# Altium schematic sheet Temperature_Sensing.SchDoc
size A4; SheetNumber: 5; SheetTotal: 6
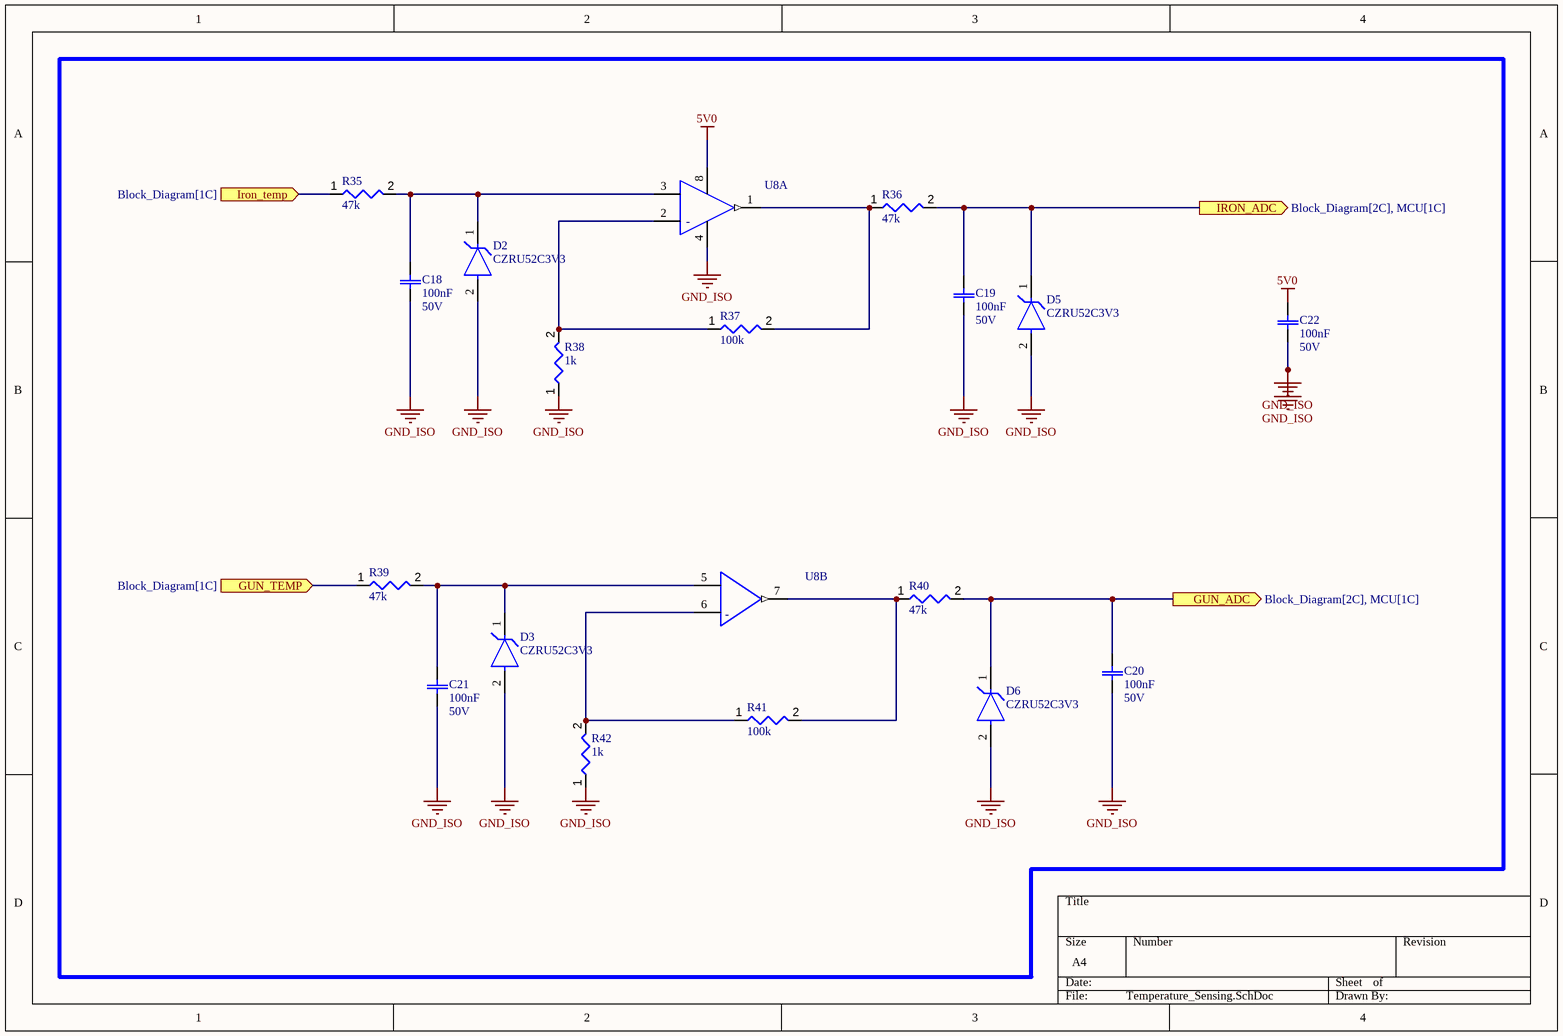
[diagram p0: Temperature_Sensing.SchDoc]

## Parts
C18  value 100nF  Voltage Rating: 50V  [Generic Ceramic 0603 CAP]  (hidden comment: CAP-MLCC_SMD-0603_MR-GCM_u_0.1uF_50V_10%_X8L)
C19  value 100nF  Voltage Rating: 50V  [Generic Ceramic 0603 CAP]  (hidden comment: CAP-MLCC_SMD-0603_MR-GCM_u_0.1uF_50V_10%_X8L)
C20  value 100nF  Voltage Rating: 50V  [Generic Ceramic 0603 CAP]  (hidden comment: CAP-MLCC_SMD-0603_MR-GCM_u_0.1uF_50V_10%_X8L)
C21  value 100nF  Voltage Rating: 50V  [Generic Ceramic 0603 CAP]  (hidden comment: CAP-MLCC_SMD-0603_MR-GCM_u_0.1uF_50V_10%_X8L)
C22  value 100nF  Voltage Rating: 50V  [Generic Ceramic 0603 CAP]  (hidden comment: CAP-MLCC_SMD-0603_MR-GCM_u_0.1uF_50V_10%_X8L)
D2  CZRU52C3V3  [FP-0603-SOD-523F-MFG]
D3  CZRU52C3V3  [FP-0603-SOD-523F-MFG]
D5  CZRU52C3V3  [FP-0603-SOD-523F-MFG]
D6  CZRU52C3V3  [FP-0603-SOD-523F-MFG]
R35  value 47k  [Generic_0603_RES]  (hidden comment: RES-TK_SMD-0603_VIS-CRCW_K_47K_1/10W_1%)
R36  value 47k  [Generic_0603_RES]  (hidden comment: RES-TK_SMD-0603_VIS-CRCW_K_47K_1/10W_1%)
R37  value 100k  [Generic_0603_RES]  (hidden comment: RES-TK_SMD-0603_VIS-CRCW_K_100K_1/10W_1%)
R38  value 1k  [Generic_0603_RES]  (hidden comment: RES-TK_SMD-0603_VIS-CRCW_K_1K_1/10W_1%)
R39  value 47k  [Generic_0603_RES]  (hidden comment: RES-TK_SMD-0603_VIS-CRCW_K_47K_1/10W_1%)
R40  value 47k  [Generic_0603_RES]  (hidden comment: RES-TK_SMD-0603_VIS-CRCW_K_47K_1/10W_1%)
R41  value 100k  [Generic_0603_RES]  (hidden comment: RES-TK_SMD-0603_VIS-CRCW_K_100K_1/10W_1%)
R42  value 1k  [Generic_0603_RES]  (hidden comment: RES-TK_SMD-0603_VIS-CRCW_K_1K_1/10W_1%)
U8  LM358DR  [FP-D0008A-MFG]  (value not drawn)  (parts A,B of 2)

## Ports
GUN_ADC (out, see Block_Diagram[2C], MCU[1C]), GUN_TEMP (in, see Block_Diagram[1C]), IRON_ADC (out, see Block_Diagram[2C], MCU[1C]), Iron_temp (in, see Block_Diagram[1C])

## Nets
5V0: C22.2 U8.8(V+)
GND_ISO: C18.1 C19.1 C20.1 C21.1 C22.1 D2.2(A) D3.2(A) D5.2(A) D6.2(A) R38.1 R42.1 U8.4(V-)
GUN_ADC: C20.2 D6.1(C) R40.2 ; port GUN_ADC
GUN_TEMP: R39.1 ; port GUN_TEMP
IRON_ADC: C19.2 D5.1(C) R36.2 ; port IRON_ADC
Iron_temp: R35.1 ; port Iron_temp
NetC18_2: C18.2 D2.1(C) R35.2 U8.3(IN1+)
NetC21_2: C21.2 D3.1(C) R39.2 U8.5(IN2+)
NetR36_1: R36.1 R37.2 U8.1(1OUT)
NetR37_1: R37.1 R38.2 U8.2(IN1-)
NetR40_1: R40.1 R41.2 U8.7(2OUT)
NetR41_1: R41.1 R42.2 U8.6(IN2-)

## Notes on the sheet
- (in symbol CMP-1685-00009-2, part A) -
- (in symbol CMP-1685-00009-2, part B) -

## Library data of the parts
C18-C22 = CMP-001-00115-11: Ceramic Capacitor, Multilayer, Ceramic, 50V, 10% +Tol, 10% -Tol, X8L, -40/+15% TC, 0.1uF, Surface Mount, 0603; Automotive: AEQ-200; Min Operating Temperature: -55°C; Case/Package: 0603; Mounting Technology: Surface Mount; RoHS Compliant: Yes; Capacitor Type: Ceramic; Pins: 2; Max Operating Temperature: 150°C
D2 D3 D5 D6 = CMP-20229-000003-1: DIODE ZENER 3.3V 150MW 0603; Zener Current: 5mA; Tolerance: 5%; Output Current: 500mA; Impedance: 95R; Element Configuration: Single; Max Reverse Leakage Current: 25uA; Max Operating Temperature: 125°C; Max Power Dissipation: 150mW; Power Rating: 150mW; Lead Free: Lead Free; Mount: Surface Mount; Packaging: Tape and Reel; Voltage Tolerance: 5%; Power Dissipation: 150mW; Zener Voltage: 3.3V; Min Operating Temperature: -55°C; Case/Package: SMD/SMT; Voltage Rating (DC): 3.3V; Package Quantity: 1
R35 R36 R39 R40 = CMP-009-00207-2: Fixed Resistor, Metal Glaze/thick Film, 0.1W, 47000ohm, 75V, 1% +/-Tol, 100ppm/Cel, Surface Mount, 0603; Power: 100mW; Case/Package: 0603; Max Operating Temperature: 155°C; Voltage Rating: 75V; RoHS Compliant: Yes; Min Operating Temperature: -55°C; Tolerance: 1%; Mounting Technology: Surface Mount; Pins: 2
R37 R41 = CMP-009-00230-4: Fixed Resistor, Metal Glaze/thick Film, 0.1W, 100000ohm, 75V, 1% +/-Tol, 100ppm/Cel, Surface Mount, 0603; Power: 100mW; Pins: 2; Max Operating Temperature: 155°C; Mounting Technology: Surface Mount; Case/Package: 0603; RoHS Compliant: Yes; Voltage Rating: 75V; Tolerance: 1%; Min Operating Temperature: -55°C
R38 R42 = CMP-009-00300-1: Fixed Resistor, Metal Glaze/thick Film, 0.1W, 1000ohm, 75V, 1% +/-Tol, 100ppm/Cel, Surface Mount, 0603; Power: 100mW; Mounting Technology: Surface Mount; Max Operating Temperature: 155°C; Pins: 2; Min Operating Temperature: -55°C; Tolerance: 1%; RoHS Compliant: Yes; Case/Package: 0603; Voltage Rating: 75V
U8 = CMP-1685-00009-2: IC OPAMP GP 2 CIRCUIT 8SOIC; Output Current: 30mA; Min Dual Supply Voltage: 1.5V; Input Offset Voltage (Vos): 7mV; Power Supply Rejection Ratio (PSRR): 65dB; Unity Gain Bandwidth Product: 700kHz; Number of Channels: 2; Min Supply Voltage: 3V; Max Dual Supply Voltage: 16V; Dual Supply Voltage: 9V; Max Supply Voltage: 32V; Nominal Supply Current: 1.2mA; Slew Rate: 0.3V/µs; Input Bias Current: 250nA; Voltage Gain: 100dB; Operating Supply Current: 1mA; REACH SVHC: No SVHC; Package Quantity: 2500; Width: 3.91mm; Max Operating Temperature: 70°C; Min Operating Temperature: 0°C; Mount: Surface Mount; Length: 4.9mm; Radiation Hardening: No; Case/Package: SOIC; Lead Free: Lead Free; Number of Elements: 2; Packaging: Tape and Reel; Output Current per Channel: 30mA; Number of Circuits: 2; Bandwidth: 700kHz; Operating Supply Voltage: 16V; Gain Bandwidth Product: 700kHz; Number of Pins: 8; Number of Amplifiers: 2; Height: 1.58mm; Common Mode Rejection Ratio: 65dB; Contact Plating: Gold